# EAGLE design MINIM_PCB (EAGLE 9.0.1)
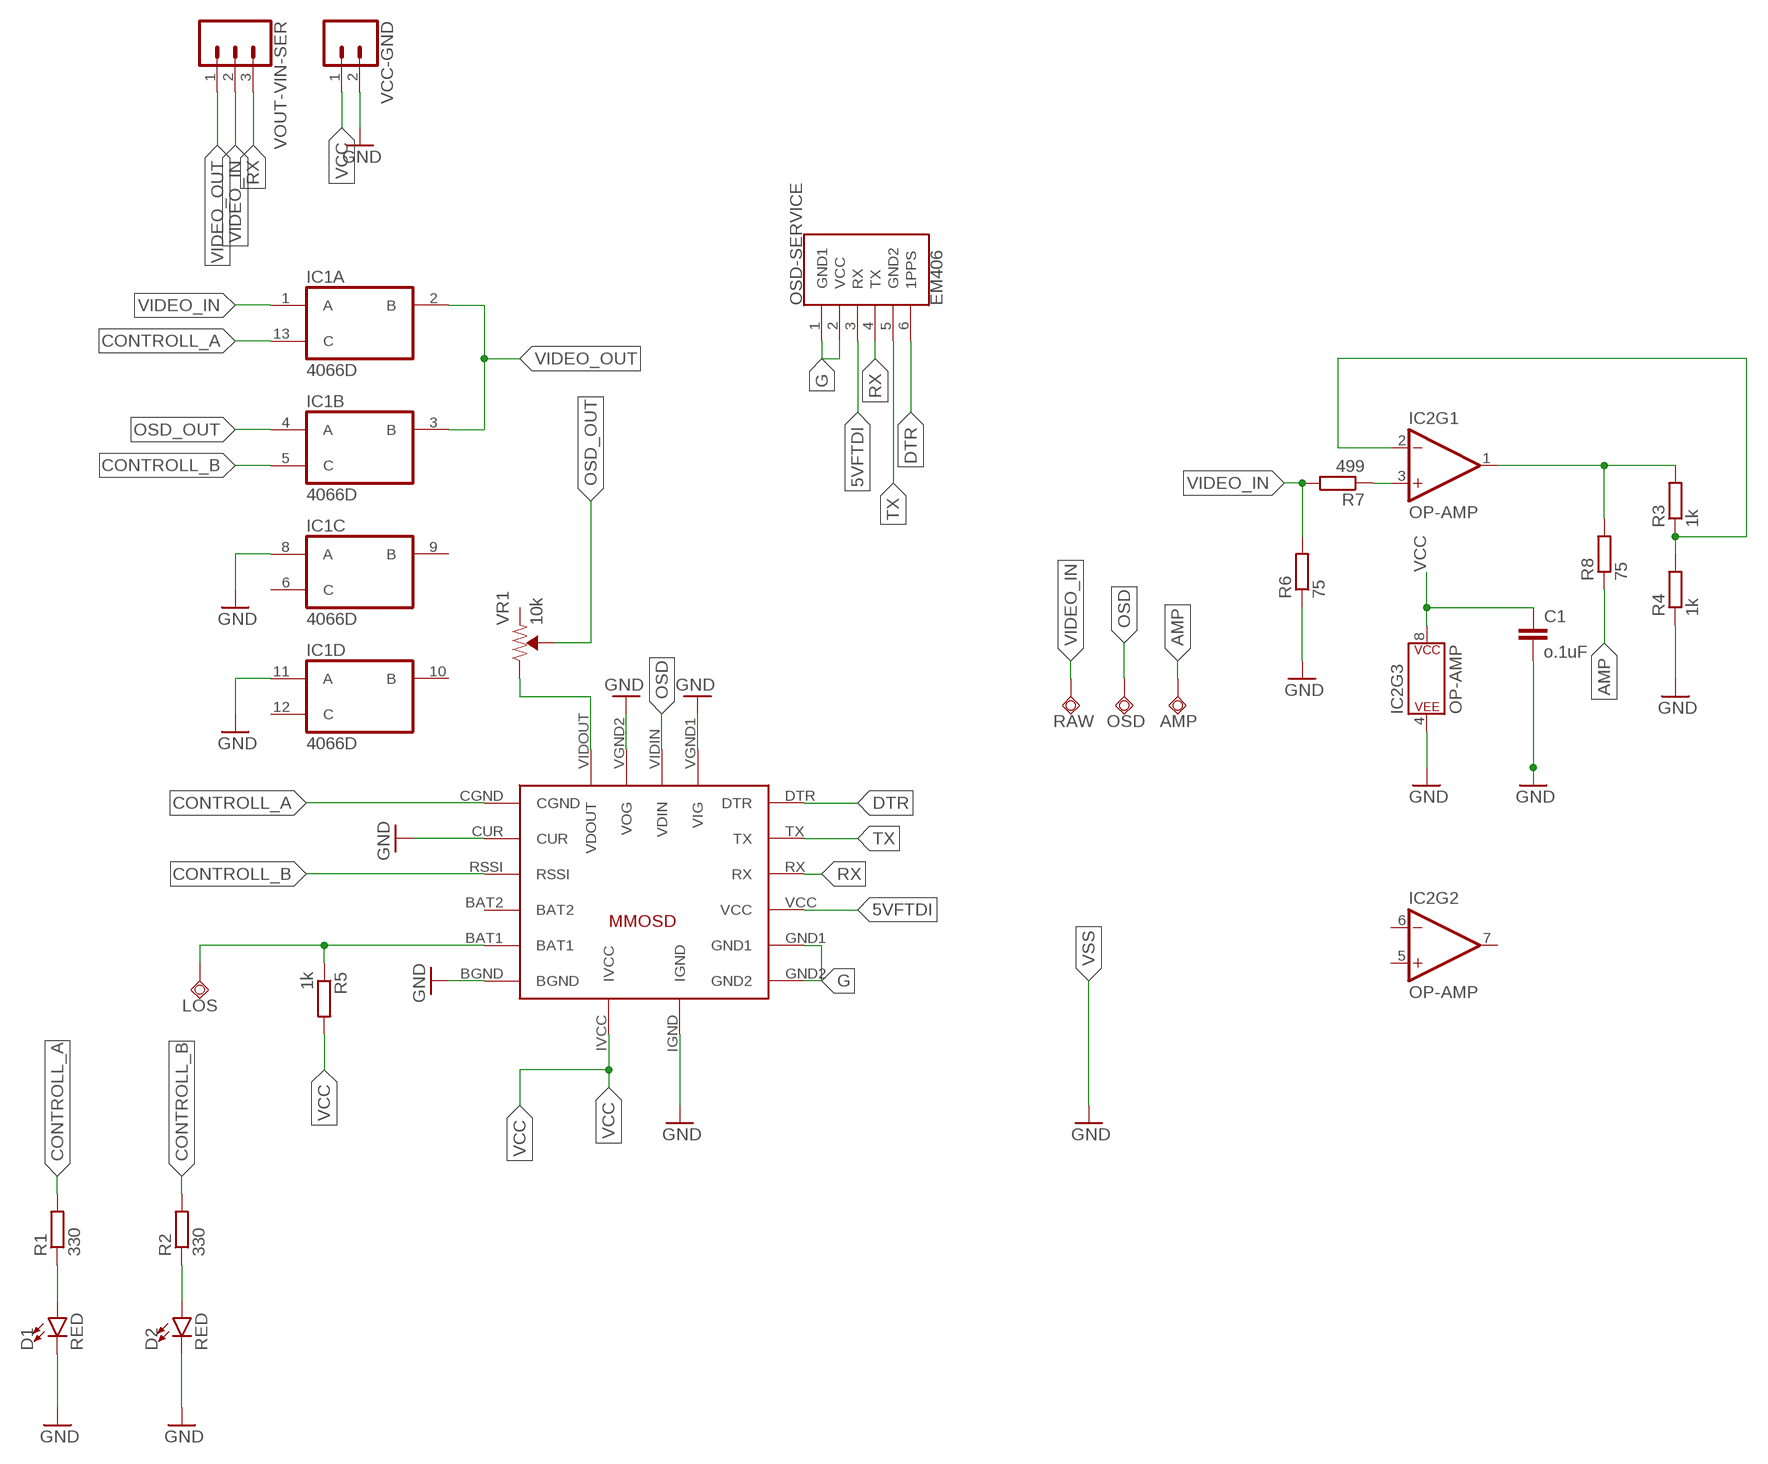
[diagram p0: schematic, sheet 1]

## Parts
AMP  TPSQTP13SQ  [TP13SQ]
C1  o.1uF  C-EUC0603K  [C0603K]
D1  RED  LED-RED1206  [LED-1206]
D2  RED  LED-RED1206  [LED-1206]
IC1  4066D  [SO14]
IC2  OP-AMP  OPAMP-DUALU  [SO08]
LOS  TPSQTP13SQ  [TP13SQ]
MINIMOSD  MICROMINIMOSDPWR  [MMOSDNVDVID]
OSD  TPSQTP13SQ  [TP13SQ]
OSD-SERVICE  EM406  [1X06-1MM]
R1  330  R-EU_R0603  [R0603]
R2  330  R-EU_R0603  [R0603]
R3  1k  R-EU_R0603  [R0603]
R4  1k  R-EU_R0603  [R0603]
R5  1k  R-EU_R0603  [R0603]
R6  75  R-EU_R0603  [R0603]
R7  499  R-EU_R0603  [R0603]
R8  75  R-EU_R0603  [R0603]
RAW  TPSQTP13SQ  [TP13SQ]
VCC-GND  CONN_02  [1X02]
VOUT-VIN-SER  CONN_03  [1X03]
VR1  10k  TRIMPOT-SMD-3MM-CLOSED-1/8W-20%  [TRIMPOT-SMD-3MM-CLOSED]

## Nets
5VFTDI: MINIMOSD.VCC OSD-SERVICE.3(RX)
75: IC2.1(OUT) R3.2 R8.2
AMP: AMP.TP R8.1
CONTROLL_A: IC1.13(A:C) MINIMOSD.CGND R1.2
CONTROLL_B: IC1.5(B:C) MINIMOSD.RSSI R2.2
DTR [thin]: MINIMOSD.DTR OSD-SERVICE.6(1PPS)
G: MINIMOSD.GND1 MINIMOSD.GND2 OSD-SERVICE.1(GND1) OSD-SERVICE.2(VCC)
GND: C1.2 D1.C D2.C IC1.8(C:A) IC1.11(D:A) IC2.4(P$V-) MINIMOSD.BGND MINIMOSD.CUR MINIMOSD.IGND MINIMOSD.VGND1(VIG) MINIMOSD.VGND2(VOG) R4.1 R6.1 VCC-GND.2
N$1: D2.A R2.1
N$2: D1.A R1.1
N$3: LOS.TP MINIMOSD.BAT1 R5.1
N$4: IC2.2(-IN) R3.1 R4.2
N$6 [medium]: MINIMOSD.VIDOUT(VDOUT) VR1.3(CW)
OSD: MINIMOSD.VIDIN(VDIN) OSD.TP
OSD_OUT [medium]: IC1.4(B:A) VR1.2(WIPER)
RX [thin]: MINIMOSD.RX OSD-SERVICE.4(TX) VOUT-VIN-SER.3
TX: MINIMOSD.TX OSD-SERVICE.5(GND2)
VCC: C1.1 IC2.8(P$V+) MINIMOSD.IVCC R5.2 VCC-GND.1
VIDEO_IN: IC1.1(A:A) R6.2 R7.2 RAW.TP VOUT-VIN-SER.2
VIDEO_OUT [medium]: IC1.2(A:B) IC1.3(B:B) VOUT-VIN-SER.1
VIDIN_AMP: IC2.3(+IN) R7.1
Unconnected: IC1.6(C:C) IC1.9(C:B) IC1.10(D:B) IC1.12(D:C) IC2.5(+IN) IC2.6(-IN) IC2.7(OUT) VR1.1(CCW)

## Power pins joined to a net without a drawn wire
BAT2: MINIMOSD.BAT2
VCC: IC1.14(P:VDD)
VSS: IC1.7(P:VSS)

## Library data of the parts
AMP LOS OSD RAW = testpad:TPSQ: Test pad
C1 = rcl:C-EU: CAPACITOR, European symbol; SPICEPREFIX: C
D1 D2 = SparkFun-LED:LED-RED: Red SMD LED Used in manufacturing of most products at SparkFun Packages: 0603 - SMD 0603 package [Product Link] <http://docs.avagotech.com/docs/AV02-0551EN> 0603 SMART - SMD 0603 SMART package ( more efficient and expensive)[Product Link] <http://www.osram-os.com/Graphics/XPic2/00077099_0.pdf> 1206 - SMD1206 package [Product Link] <https://www.sparkfun.com/datasheets/DevTools/LilyPad/Q150OVS4.pdff> SparkFun Products: Pro Mini 328 -5V <https://www.sparkfun.com/products/821> RedBoard <https://www.sparkfun.com/products/12757> IOIO-OTG <https://www.sparkfun.com/products/13613>; PROD_ID: DIO-09912
IC1 = 40xx:4066: Quad bilateral ANALOG SWITCH
IC2 = SparkFun-IC-Amplifiers:OPAMP-DUAL: Generic op-amp footprint This component is for the standard 358 pinning of a dual op-amp From the LM358 datasheet: Pin 1: Output A Pin 2: Inverting Input A Pin 3: Non-Inverting Input A Pin 4: Gnd Pin 5: Non-Inverting Input B Pin 6: Inverting Input B Pin 7: Output B Pin 8: V+; PROD_ID: NA-XXXXX
MINIMOSD = FPVTools:MICROMINIMOSDPWR
OSD-SERVICE = SparkFun-Connectors:EM406: EM406 GPS Connector Here is a six pin vertical 1.0mm pitch connector. It is useful if you need something very tiny as a connection. These are not the standard JST type connectors we use on most of our boards, but are actually the much smaller JST-SH type. Here is the connector we sell at SparkFun: JST SH Vertical 6-Pin Connector - SMD <https://www.sparkfun.com/products/579> (GPS-00579) Datasheet <http://www.sparkfun.com/datasheets/GPS/EM406-SMDConnector-eSH.pdf> It was used on these SparkFun products: SparkFun GPS Breakout <https://www.sparkfun.com/products/11818> (BOB-11818) SparkFun Weather Shield <https://www.sparkfun.com/products/12081> (DEV-12081) And many, many other GPS related products.; PROD_ID: CONN-08249; SF_ID: GPS-00579
R1-R8 = resistor:R-EU_: RESISTOR, European symbol
VCC-GND = SparkFun-Connectors:CONN_02: Multi connection point. Often used as Generic Header-pin footprint for 0.1 inch spaced/style header connections On any of the 0.1 inch spaced packages, you can populate with these: Break Away Headers - Straight <https://www.sparkfun.com/products/116> (PRT-00116) Break Away Male Headers - Right Angle <https://www.sparkfun.com/products/553> (PRT-00553) Female Headers <https://www.sparkfun.com/products/115> (PRT-00115) Break Away Headers - Machine Pin <https://www.sparkfun.com/products/117> (PRT-00117) Break Away Female Headers - Swiss Machine Pin <https://www.sparkfun.com/products/743> (PRT-00743) For SCREWTERMINALS and SPRING TERMINALS visit here: Screw Terimnals on SparkFun.com <https://www.sparkfun.com/search/results?term=Screw+Terminals> (5mm/3.5mm/2.54mm spacing) This device is also useful as a general connection point to wire up your design to another part of your project. Our various solder wires solder well into these plated through hole pads. Hook-Up Wire - Assortment (Stranded, 22 AWG) <https://www.sparkfun.com/products/11375> (PRT-11375) Hook-Up Wire - Assortment (Solid Core, 22 AWG) <https://www.sparkfun.com/products/11367> (PRT-11367) View the entire wire category on our website here <https://www.sparkfun.com/categories/141> Special notes: Molex polarized connector foot print use with: PRT-08233 with associated crimp pins and housings. 2.54_SCREWTERM for use with PRT-10571. 3.5mm Screw Terminal footprints for PRT-08084 5mm Screw Terminal footprints for use with PRT-08432
VOUT-VIN-SER = SparkFun-Connectors:CONN_03: Multi connection point. Often used as Generic Header-pin footprint for 0.1 inch spaced/style header connections On any of the 0.1 inch spaced packages, you can populate with these: Break Away Headers - Straight <https://www.sparkfun.com/products/116> (PRT-00116) Break Away Male Headers - Right Angle <https://www.sparkfun.com/products/553> (PRT-00553) Female Headers <https://www.sparkfun.com/products/115> (PRT-00115) Break Away Headers - Machine Pin <https://www.sparkfun.com/products/117> (PRT-00117) Break Away Female Headers - Swiss Machine Pin <https://www.sparkfun.com/products/743> (PRT-00743) Stackable Header - 3 Pin (Female, 0.1") <https://www.sparkfun.com/products/13875> (PRT-13875) For SCREWTERMINALS and SPRING TERMINALS visit here: Screw Terimnals on SparkFun.com <https://www.sparkfun.com/search/results?term=Screw+Terminals> (5mm/3.5mm/2.54mm spacing) This device is also useful as a general connection point to wire up your design to another part of your project. Our various solder wires solder well into these plated through hole pads. Hook-Up Wire - Assortment (Stranded, 22 AWG) <https://www.sparkfun.com/products/11375> (PRT-11375) Hook-Up Wire - Assortment (Solid Core, 22 AWG) <https://www.sparkfun.com/products/11367> (PRT-11367) View the entire wire category on our website here <https://www.sparkfun.com/categories/141> Special notes: Molex polarized connector foot print use with SKU : PRT-08232 with associated crimp pins and housings.
VR1 = SparkFun-Resistors:TRIMPOT: Trimming Potentiometer (Trimpot) Three-terminal potentiometers, with an adjustable wiper and two adjustable resistors. A pot can be used to create a configurable voltage divider, or as a variable resistor. "Trimpots" are a subset of potentiometers, usually intended for "set-and-forget" applications. They're often more delicate than standard potentiometers - rated for fewer turns. Variants PTH-KNOB - PTH Trimpot w/ finger-adjustable knob Trimpot 10K with Knob <https://www.sparkfun.com/products/9806> (COM-09806) Datasheet <http://www.sparkfun.com/datasheets/Components/General/TSR-3386.pdf> SMD-3MM-CLOSED-FRAME - SMD 3mm Square Closed-Frame Trimpot Used on e.g. EasyDriver - Stepper Motor Driver <https://www.sparkfun.com/products/12779> Datasheet <http://www.bitechnologies.com/pdfs/22.pdf> (22AR10KTR) SMD-5MM - SMD 5mm Square Closed-Frame Trimpot Used on e.g. IOIO-OTG - V2.2 <https://www.sparkfun.com/products/13613> Datasheet <http://www.vishay.com/docs/51008/ts53.pdf> (TS53YL502MR10) SMD-3MM-1/10W-25% - 3mm Square Open-Frame Trimpot Used on e.g. SparkFun Shapeoko <https://www.sparkfun.com/products/13899> Datasheet <http://www.bourns.com/docs/Product-Datasheets/TC33.pdf> (TC33X-2-103E); PROD_ID: RES-09285

## Net classes
0 default: width 0.4 mm, drill 0.3 mm, clearance 0.3 mm
1 thin: width 0.4 mm, drill 0.3 mm, clearance 0.3 mm
2 medium: width 0.4 mm, drill 0.3 mm, clearance 0.3 mm
3 d_cl: width 0.4 mm, drill 0.3 mm, clearance 0.3 mm

## Board
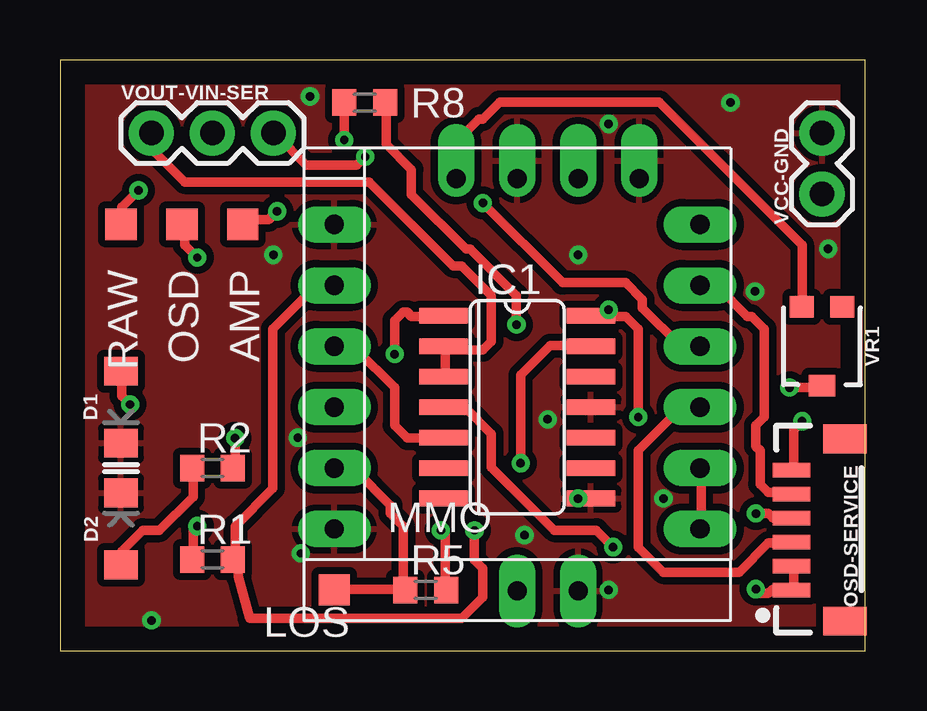
[diagram p1: board, top side]
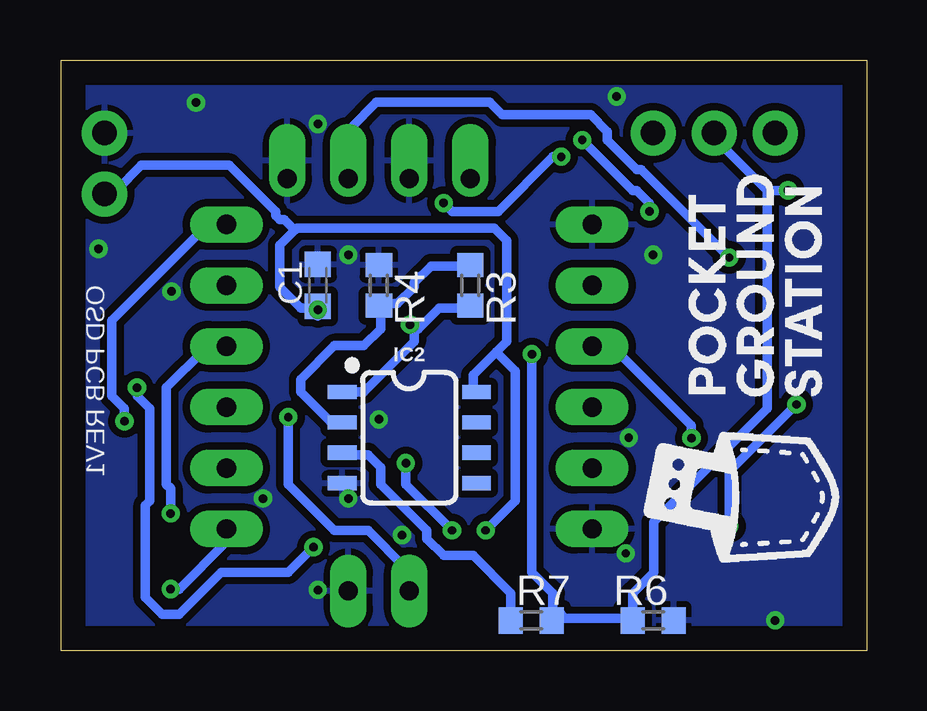
[diagram p2: board, bottom side, seen from below]

Size 33.55 x 24.64 mm. Coordinates in mm from the lower left corner, seen from the top.
Outline: 33.55,0 33.55,24.64 0,24.64 0,0 33.55,0
Copper layers (1*16): Top 0.035mm / dielectric 1.5mm / Bottom 0.035mm
Design rules "PCB Albert *": minimum track width 0.15mm, minimum drill 0.35mm, track to track 0.205mm, track to pad 0.205mm, pad to pad 0.205mm, via to via 0.205mm, smd to smd 6mil, copper to edge 40mil, drill to drill 6mil, minimum pad ring 10mil, minimum via ring 8mil, stop-mask expansion 4mil, vias tented up to drill 2mm, thermal gap 10mil

### Footprints (pad centres in the part's own frame; a part is rotated, then mirrored left to right if it is on the bottom)
TP13SQ = smd 1.3 x 1.3: TP 0,0
C0603K = smd 1.05 x 1.08: 1 -0.875,0; 2 0.875,0
LED-1206 = smd 1.2 x 1.4: A -1.5,0; C 1.5,0
SO14 = smd 0.66 x 2.032: 1 -3.81,-3.073; 2 -2.54,-3.073; 3 -1.27,-3.073; 4 0,-3.073; 5 1.27,-3.073; 6 2.54,-3.073; 7 3.81,-3.073; 8 3.81,3.073; 9 2.54,3.073; 10 1.27,3.073; 11 0,3.073; 12 -1.27,3.073; 13 -2.54,3.073; 14 -3.81,3.073
SO08 = smd 0.6 x 1.2: 1 -1.905,-2.8; 2 -0.635,-2.8; 3 0.635,-2.8; 4 1.905,-2.8; 5 1.905,2.8; 6 0.635,2.8; 7 -0.635,2.8; 8 -1.905,2.8
MMOSDNVDVID = drill 0.8 pad 1.524 long: BAT1 -7.62,-3.81; BAT2 -7.62,-1.27; BGND -7.62,-6.35; CGND -7.62,3.81; CUR -7.62,6.35; DTR 7.62,6.35; GND1 7.62,-3.81; GND2 7.62,-6.35; IGND 2.54,-8.93; IVCC 0,-8.93; RSSI -7.62,1.27; RX 7.62,1.27; TX 7.62,3.81; VCC 7.62,-1.27 | drill 0.8 pad 1.524 offset: VGND1 0,8.255; VGND2 5.08,8.255; VIDIN 2.54,8.255; VIDOUT -2.54,8.255
1X06-1MM = smd 0.6 x 1.55: 1 -2.54,1.27; 2 -1.54,1.27; 3 -0.54,1.27; 4 0.46,1.27; 5 1.46,1.27; 6 2.46,1.27 | smd 1.2 x 1.8: P$1 -3.84,-0.955; P$2 3.76,-0.955
R0603 = smd 1 x 1.1: 1 -0.85,0; 2 0.85,0
1X02 = drill 1.016 pad 1.88: 1 0,0; 2 2.54,0
1X03 = drill 1.016 pad 1.88: 1 0,0; 2 2.54,0; 3 5.08,0
TRIMPOT-SMD-3MM-CLOSED = smd 1 x 0.9: 1 -0.85,-1.65; 3 0.85,-1.65 | smd 1.1 x 0.9: 2 0,1.65

### Placement (x,y rotation side)
AMP  7.62,17.78 0 top
C1  22.86,15.24 90 bottom
D1  2.54,10.16 270 top
D2  2.54,5.08 90 top
IC1  19.05,10.16 270 top
IC2  19.05,8.89 270 bottom
LOS  11.43,2.54 180 top
MINIMOSD  19.05,11.43 0 top
OSD  5.08,17.78 0 top
OSD-SERVICE  31.75,5.08 90 top
R1  6.35,3.81 0 top
R2  6.35,7.62 0 top
R3  16.51,15.24 270 bottom
R4  20.32,15.24 270 bottom
R5  15.24,2.54 0 top
R6  8.89,1.27 180 bottom
R7  13.97,1.27 0 bottom
R8  12.7,22.86 0 top
RAW  2.54,17.78 0 top
VCC-GND  31.75,19.05 90 top
VOUT-VIN-SER  3.81,21.59 0 top
VR1  31.75,12.7 180 top

### Tracks (layer width: path | path; a pad name or v marks a point on that pad's centre or on a via)
5VFTDI
  Top 0.4: OSD-SERVICE.3 30.4,4.5 29.52,4.5 28.3,3.28 25.15,3.28 24.09,4.33 24.09,8.35 25.84,10.1 26.55,10.1 MINIMOSD.VCC
75  (via drill 0.35)
  Top 0.4: v19.02,13.6 19.02,14.83 17.09,16.75 16.92,16.75 14.64,19.03 14.64,20.08 13.59,21.12 13.59,22.7 R8.2
  Bottom 0.4: R3.2 16.57,14.3 17.8,14.3 18.67,13.42 18.84,13.42 v19.02,13.6 18.84,13.25 18.84,12.9 20.95,10.8 21.82,10.8 IC2.1
AMP  (via drill 0.35)
  Top 0.4: v11.84,21.3 11.84,22.7 R8.1 | v9.05,18.33 8.7,17.98 7.82,17.98 7.64,17.8 AMP.TP
  Bottom 0.4: v11.84,21.3 9.75,19.2 9.57,19.2 9.05,18.67 v9.05,18.33
CONTROLL_A  (via drill 0.35)
  Top 0.4: MINIMOSD.CGND 11.32,15.17 10.62,15.17 8.87,13.42 8.87,6.78 7.3,5.2 7.3,3.98 R1.2 7.3,3.8 7.07,3.8 7.43,3.45 7.43,3.1 7.91,1.35 16.75,1.35 17.62,2.23 17.62,3.45 17.27,3.8 v17.27,5.03 | v19.2,7.83 19.2,11.5 20.42,12.73 21.99,12.73 IC1.13
  Bottom 0.4: v19.2,7.83 19.2,6.95 v17.27,5.03
CONTROLL_B  (via drill 0.35)
  Top 0.4: v7.3,8.88 7.3,7.65 R2.2 | IC1.5 15.87,8.88 14.47,8.88 13.95,9.4 13.95,10.98 12.37,12.55 11.5,12.55 MINIMOSD.RSSI
  Bottom 0.4: v7.3,8.88 7.3,9.4 10.45,12.55 11.32,12.55 MINIMOSD.RSSI
DTR  (via drill 0.35)
  Top 0.4: v30.92,9.58 30.57,9.23 30.57,7.65 OSD-SERVICE.6
  Bottom 0.4: v30.92,9.58 30.92,10.1 31.45,10.62 31.45,13.78 27.59,17.62 26.72,17.62 MINIMOSD.DTR
G  (via drill 0.35)
  Top 0.4: OSD-SERVICE.2 30.57,3.45 30.57,2.58 OSD-SERVICE.1 30.4,2.58 29.7,2.58 29.52,2.4 29.17,2.4 v28.99,2.58 | MINIMOSD.GND1 26.72,7.48 26.72,5.2 MINIMOSD.GND2
  Bottom 0.4: v28.99,2.58 28.65,2.58 26.72,4.5 26.72,5.03 MINIMOSD.GND2
GND  (via drill 0.35)
  other vias: 8.89,16.51 21.59,16.51 21.59,6.35 20.32,9.65 9.91,8.89 19.35,4.83 27.94,22.86 10.03,4.06 28.96,14.99 3.81,1.27 22.86,21.97 22.86,2.54 25.15,6.35 32,16.76 10.41,23.11
  pour Bottom: -12.7,25.4 -12.7,-2.54 35.56,-2.54 35.56,25.4
  pour Top: -13.97,26.67 35.56,26.67 35.56,-2.54 -13.97,-2.54
N$1
  Top 0.4: R2.1 5.55,7.48 5.55,6.43 4.14,5.03 3.45,5.03 2.57,4.15 2.57,3.62 D2.A
N$2  (via drill 0.35)
  Top 0.4: v5.72,5.2 5.55,5.03 5.55,3.98 R1.1 | v2.92,10.28 2.57,10.62 2.57,11.5 D1.A
  Bottom 0.4: v5.72,5.2 5.72,7.48 v2.92,10.28
N$3
  Top 0.4: LOS.TP 11.5,2.58 14.3,2.58 R5.1 14.3,2.75 14.3,5.2 13.77,5.73 13.77,6.08 12.37,7.48 11.5,7.48 MINIMOSD.BAT1
N$4
  Bottom 0.4: R3.1 16.57,16.05 18.14,16.05 18.84,15.35 18.84,15.17 19.55,14.48 20.25,14.48 R4.2 20.25,14.3 20.25,13.42 20.95,12.73 22.17,12.73 23.57,11.33 23.57,10.8 22.34,9.58 21.99,9.58 IC2.2
N$6
  Top 0.4: VR1.3 30.92,14.48 30.92,16.92 24.97,22.88 18.32,22.88 17.62,22.17 17.45,22.17 16.57,21.3 16.57,19.73 MINIMOSD.VIDOUT
OSD  (via drill 0.35)
  Top 0.4: v5.72,16.4 5.2,16.92 5.2,17.62 OSD.TP
  Bottom 0.4: v5.72,16.4 9.39,20.08 9.57,20.08 10.8,21.3 10.8,21.65 11.5,22.35 15.17,22.35 15.7,22.88 20.42,22.88 21.47,21.83 21.47,19.73 MINIMOSD.VIDIN
OSD_OUT  (via drill 0.35)
  Top 0.4: v30.4,10.98 31.62,10.98 VR1.2 | v23.05,4.33 22.34,5.03 20.59,5.03 17.97,7.65 17.97,9.05 16.92,10.1 16.05,10.1 IC1.4
  Bottom 0.4: v30.4,10.98 30.4,10.62 29.87,10.1 29.87,6.25 30.05,6.08 30.05,2.23 29.34,1.53 28.65,1.53 26.9,3.28 24.09,3.28 v23.05,4.33
RX  (via drill 0.35)
  Top 0.4: v28.99,5.73 29.52,5.73 29.7,5.55 30.4,5.55 OSD-SERVICE.4 | v12.72,20.6 12.37,20.25 10.27,20.25 9.05,21.48 VOUT-VIN-SER.3 | v17.62,18.67 20.95,15.35 23.57,15.35 24.27,14.65 24.27,14.3 25.84,12.73 26.55,12.73 MINIMOSD.RX
  Bottom 0.4: v28.99,5.73 28.99,6.78 29.17,6.95 29.17,10.98 27.59,12.55 26.72,12.55 MINIMOSD.RX | v12.72,20.6 13.07,20.6 15.34,18.33 17.27,18.33 v17.62,18.67
TX
  Top 0.4: OSD-SERVICE.5 30.4,6.6 29.52,6.6 29.17,6.95 29.17,8.35 28.99,8.53 28.99,9.4 29.34,9.75 29.34,13.42 28.82,13.95 28.65,13.95 27.42,15.17 26.72,15.17 MINIMOSD.TX
VCC  (via drill 0.35)
  Top 0.4: v15.87,5.03 16.05,4.85 16.05,2.58 R5.2 | v24.09,9.75 24.09,13.42 23.57,13.95 22.17,13.95 IC1.14 22.86,13.97 v22.86,14.22
  Bottom 0.4: 23.83,17.54 23.74,17.62 15.52,17.62 15,17.1 15,12.9 15.43,12.46 | 23.83,17.54 24.45,16.92 24.45,15.17 23.57,14.3 22.87,14.3 C1.1 v22.86,14.22 22.86,13.97 | 15.43,12.46 16.39,11.5 16.39,10.8 IC2.8 | v15.87,5.03 14.64,6.25 14.64,11.68 15.43,12.46 | 23.83,17.54 24.27,17.98 24.45,17.98 24.62,18.15 24.62,18.33 26.55,20.25 30.22,20.25 31.27,19.2 31.62,19.2 VCC-GND.1 | v24.09,9.75 24.09,6.95 22.17,5.03 20.77,5.03 19.2,3.45 19.2,2.58 MINIMOSD.IVCC
VIDEO_IN  (via drill 0.35)
  Top 0.4: v3.27,19.2 2.57,18.5 2.57,17.8 RAW.TP | v13.95,12.38 13.95,13.78 14.3,14.12 14.47,14.12 14.64,13.95 15.87,13.95 IC1.1
  Bottom 0.4: 4.14,19.2 v3.27,19.2 | 4.14,19.2 6.42,21.48 VOUT-VIN-SER.2 | v13.95,12.38 13.95,3.28 13.07,2.4 13.07,1.7 13.25,1.53 13.25,1.35 R7.2 13.07,1.35 12.89,1.53 12.72,1.53 12.55,1.35 9.75,1.35 R6.2 9.57,1.35 9.57,1.53 9.75,1.7 9.75,2.4 8.87,3.28 8.87,5.38 4.14,10.1 4.14,19.2
VIDEO_OUT
  Top 0.4: IC1.3 16.05,11.5 16.05,12.55 IC1.2 16.22,12.55 17.62,12.55 17.97,12.9 17.97,14.83 16.75,16.05 16.39,16.05 12.89,19.55 5.2,19.55 3.97,20.78 3.97,21.48 VOUT-VIN-SER.1
VIDIN_AMP
  Bottom 0.4: R7.1 14.82,2.4 16.39,3.98 17.62,3.98 18.32,4.68 18.32,5.03 20.25,6.95 20.25,7.65 20.77,8.18 21.82,8.18 IC2.3

### Text on the board
bNames: OSD PCB REV1